# Altium schematic sheet BarrelJack.SchDoc
size B
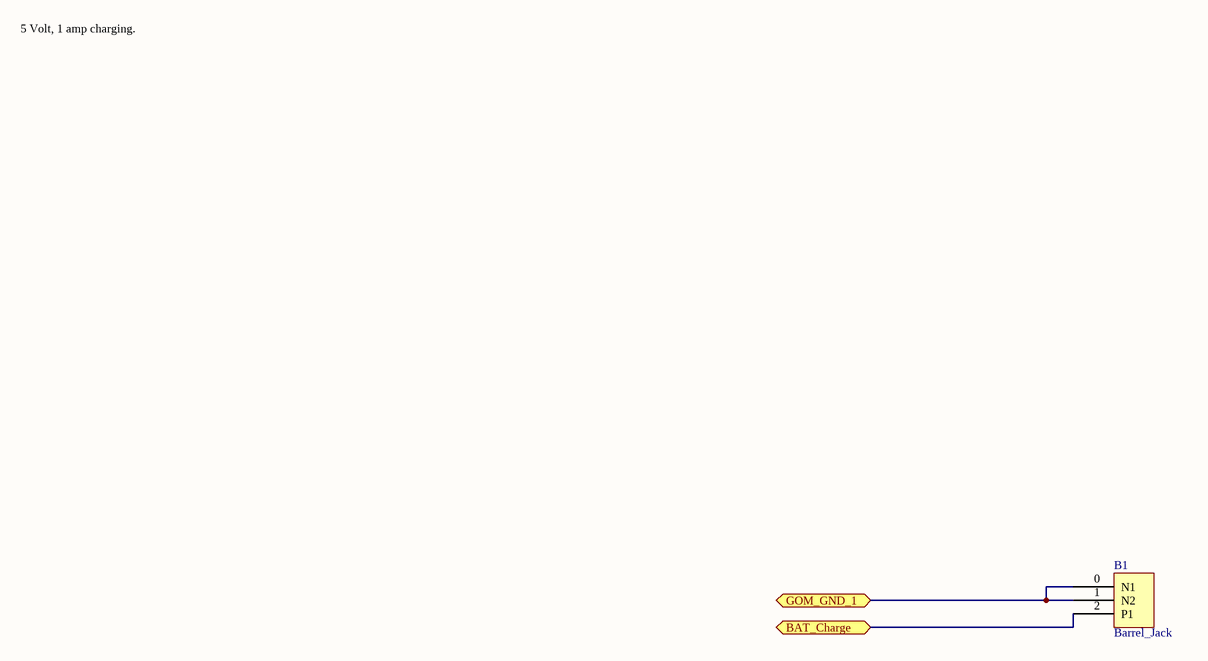
[diagram p0: BarrelJack.SchDoc]

## Parts
B1  Barrel_Jack  [Barrel_Jack]

## Ports
BAT_Charge (bidir), GOM_GND_1 (bidir)

## Nets
BAT_Charge: B1.2(P1) ; port BAT_Charge
GOM_GND_1: B1.0(N1) B1.1(N2) ; port GOM_GND_1

## Notes on the sheet
- 5 Volt, 1 amp charging.